# EAGLE design AmazonDash (EAGLE 7.7.0)
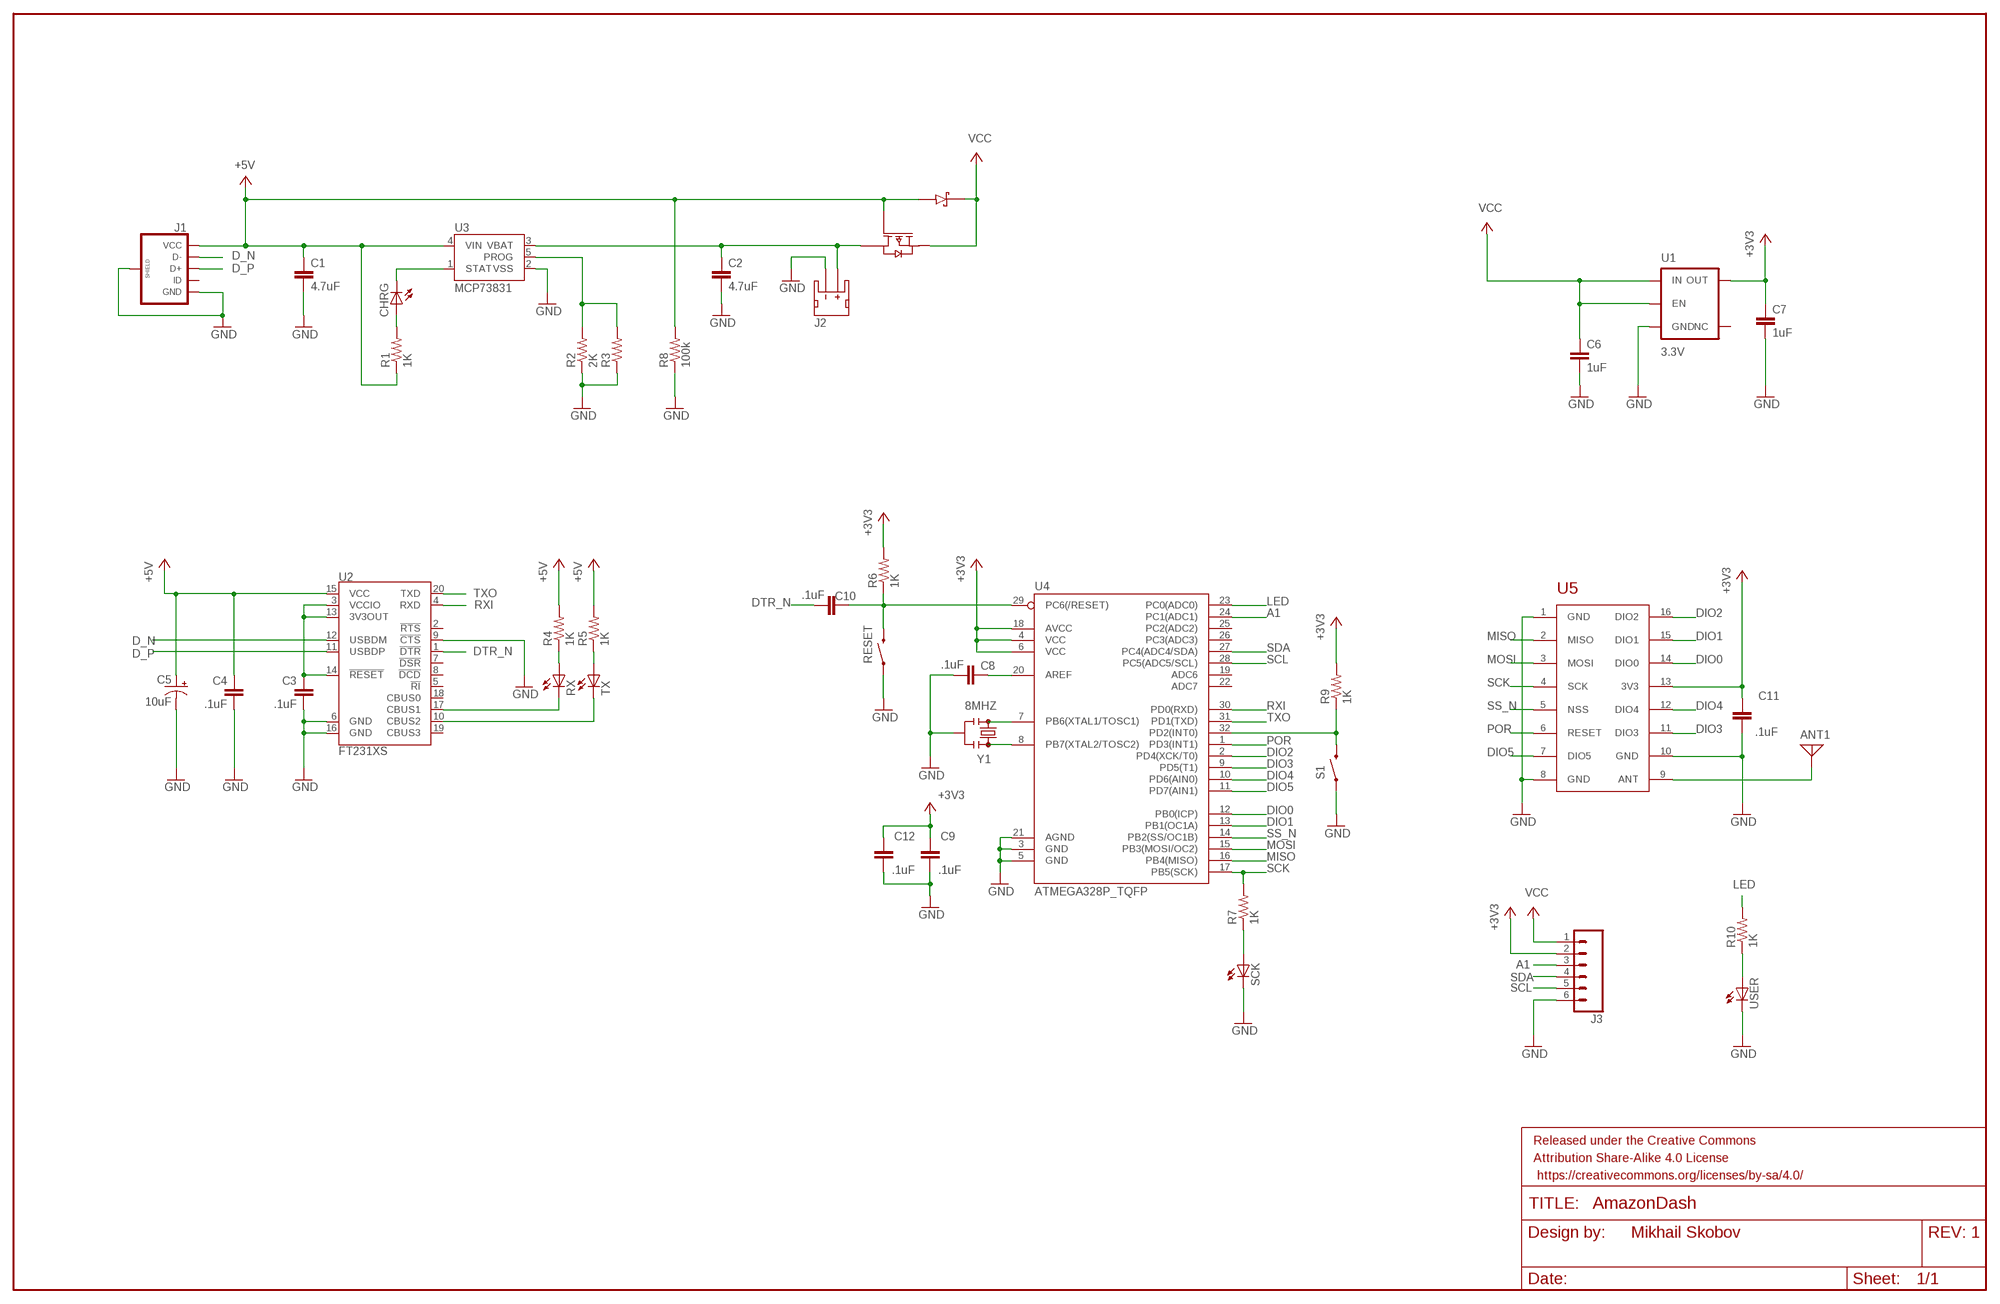
[diagram p0: schematic, sheet 1]

## Parts
ANT1  ANTENNA  [PAD-01]
C1  4.7uF  C-EUC0805  [C0805]
C2  4.7uF  C-EUC0805  [C0805]
C3  .1uF  C-EUC0805  [C0805]
C4  .1uF  C-EUC0805  [C0805]
C5  10uF  10UF-16V-10%(TANT)  [EIA3216]
C6  1uF  C-EUC0805  [C0805]
C7  1uF  C-EUC0805  [C0805]
C8  .1uF  C-EUC0805  [C0805]
C9  .1uF  C-EUC0805  [C0805]
C10  .1uF  C-EUC0805  [C0805]
C11  .1uF  C-EUC0805  [C0805]
C12  .1uF  C-EUC0805  [C0805]
CHRG  LEDCHIPLED_0805  [CHIPLED_0805]
FRAME2  FRAME-LEDGER  [CREATIVE_COMMONS]
J1  USB_MICROB_PLUGCONN-11752  [USB-B-MICRO-SMD_V03]
J2  JST_2MM_MALE  [JST-2-SMD]
J3  M06LOCK  [1X06_LOCK]
R1  1K  R-US_R0805  [R0805]
R2  2K  R-US_R0805  [R0805]
R3  R-US_R0805  [R0805]
R4  1K  R-US_R0805  [R0805]
R5  1K  R-US_R0805  [R0805]
R6  1K  R-US_R0805  [R0805]
R7  1K  R-US_R0805  [R0805]
R8  100k  R-US_R0805  [R0805]
R9  1K  R-US_R0805  [R0805]
R10  1K  R-US_R0805  [R0805]
RESET  SWITCH-MOMENTARY-2SMD  [TACTILE-SWITCH-SMD]
RX  LEDCHIPLED_0805  [CHIPLED_0805]
S1  SWITCH-MOMENTARY-2SMD  [TACTILE-SWITCH-SMD]
SCK  LEDCHIPLED_0805  [CHIPLED_0805]
TX  LEDCHIPLED_0805  [CHIPLED_0805]
U1  3.3V  V_REG_AP2112K-3.3V  [SOT23-5]
U2  FT231XS  [SSOP20_L]
U3  MCP73831  [SOT23-5]
U4  ATMEGA328P_TQFP  [TQFP32-08]
U5  RFM69HCW  [RFM69]
U6  FDC6392S  [SSOT-6]
USER  LEDCHIPLED_0805  [CHIPLED_0805]
Y1  8MHZ  RESONATOR8MHZ  [RESONATOR-SMD]

## Nets
+3V3: C7.1 C9.2 C11.2 C12.2 J3.2 R6.2 R9.2 U1.5(OUT) U4.4(VCC) U4.6(VCC) U4.18(AVCC) U5.13(3V3)
+5V: C1.1 C4.1 C5.A(+) J1.VBUS(VCC) R1.1 R4.2 R5.2 R8.2 U2.15(VCC) U3.4(VIN) U6.1(A) U6.3(G)
A1: J3.3 U4.24(PC1(ADC1))
D_N [USB]: J1.D- U2.12(USBDM)
D_P [USB]: J1.D+ U2.11(USBDP)
DIO0: U4.12(PB0(ICP)) U5.14(DIO0)
DIO1: U4.13(PB1(OC1A)) U5.15(DIO1)
DIO2: U4.2(PD4(XCK/T0)) U5.16(DIO2)
DIO3: U4.9(PD5(T1)) U5.11(DIO3)
DIO4: U4.10(PD6(AIN0)) U5.12(DIO4)
DIO5: U4.11(PD7(AIN1)) U5.7(DIO5)
DTR_N: C10.1 U2.1(!DTR)
GND: C1.2 C2.2 C3.2 C4.2 C5.C(-) C6.2 C7.2 C8.1 C9.1 C11.1 C12.1 J1.GND J1.SHIELD1(SHIELD) J1.SHIELD2(SHIELD) J1.SHIELD3(SHIELD) J2.1(-) J3.6 R2.1 R3.1 R8.1 RESET.1 S1.1 SCK.C U1.2(GND) U2.6(GND) U2.9(!CTS) U2.16(GND) U3.2(VSS) U4.3(GND) U4.5(GND) U4.21(AGND) U5.1(GND) U5.8(GND) U5.10(GND) USER.C Y1.2
LED: R10.2 U4.23(PC0(ADC0))
MISO: U4.16(PB4(MISO)) U5.2(MISO)
MOSI: U4.15(PB3(MOSI/OC2)) U5.3(MOSI)
N$1: RX.C U2.17(CBUS1)
N$2: CHRG.C U3.1(STAT)
N$3: CHRG.A R1.2
N$4: R4.1 RX.A
N$5: R5.1 TX.A
N$6: R2.2 R3.2 U3.5(PROG)
N$7: TX.C U2.10(CBUS2)
N$8: C3.1 U2.3(VCCIO) U2.13(3V3OUT) U2.14(!RESET)
N$9: R9.1 S1.3 U4.32(PD2(INT0))
N$10: R10.1 USER.A
N$13: R7.1 SCK.A
N$14: C10.2 R6.1 RESET.3 U4.29(PC6(/RESET))
N$15: C8.2 U4.20(AREF)
N$16: U4.7(PB6(XTAL1/TOSC1)) Y1.1
N$17: U4.8(PB7(XTAL2/TOSC2)) Y1.3
N$28: ANT1.1 U5.9(ANT)
POR: U4.1(PD3(INT1)) U5.6(RESET)
RXI: U2.4(RXD) U4.30(PD0(RXD))
SCK: R7.2 U4.17(PB5(SCK)) U5.4(SCK)
SCL: J3.5 U4.28(PC5(ADC5/SCL))
SDA: J3.4 U4.27(PC4(ADC4/SDA))
SS_N: U4.14(PB2(SS/OC1B)) U5.5(NSS)
TXO: U2.20(TXD) U4.31(PD1(TXD))
VBAT: C2.1 J2.2(+) U3.3(VBAT) U6.4(S)
VCC: C6.1 J3.1 U1.1(IN) U1.3(EN) U6.2(D) U6.6(C)
Unconnected: J1.ID J2.NC1(PAD1) J2.NC2(PAD2) U1.4(NC) U2.2(!RTS) U2.5(!RI) U2.7(!DSR) U2.8(!DCD) U2.18(CBUS0) U2.19(CBUS3) U4.19(ADC6) U4.22(ADC7) U4.25(PC2(ADC2)) U4.26(PC3(ADC3))

## Notes on the sheet
- Mikhail Skobov | 1

## Library data of the parts
ANT1 = discrete:ANTENNA: Antenna
C1-C4 C6-C12 = resistor:C-EU: CAPACITOR, European symbol
C5 = SparkFun-Capacitors:10UF-16V-10%(TANT): CAP-00811 1206/EIA-3216 Tantalum capacitor; PROD_ID: CAP-00811
CHRG RX SCK TX USER = led:LED: LED OSRAM: - CHIPLED LG R971, LG N971, LY N971, LG Q971, LY Q971, LO R971, LY R971 LH N974, LH R974 LS Q976, LO Q976, LY Q976 LO Q996 - Hyper CHIPLED LW Q18S LB Q993, LB Q99A, LB R99A - SideLED LS A670, LO A670, LY A670, LG A670, LP A670 LB A673, LV A673, LT A673, LW A673 LH A674 LY A675 LS A676, LA A676, LO A676, LY A676, LW A676 LS A679, LY A679, LG A679 - Hyper Micro SIDELED® LS Y876, LA Y876, LO Y876, LY Y876 LT Y87S - SmartLED LW L88C, LW L88S LB L89C, LB L89S, LG L890 LS L89K, LO L89K, LY L89K LS L896, LA L896, LO L896, LY L896 - TOPLED LS T670, LO T670, LY T670, LG T670, LP T670 LSG T670, LSP T670, LSY T670, LOP T670, LYG T670 LG T671, LOG T671, LSG T671 LB T673, LV T673, LT T673, LW T673 LH T674 LS T676, LA T676, LO T676, LY T676, LB T676, LH T676, LSB T676, LW T676 LB T67C, LV T67C, LT T67C, LS T67K, LO T67K, LY T67K, LW E67C LS E67B, LA E67B, LO E67B, LY E67B, LB E67C, LV E67C, LT E67C LW T67C LS T679, LY T679, LG T679 LS T770, LO T770, LY T770, LG T770, LP T770 LB T773, LV T773, LT T773, LW T773 LH T774 LS E675, LA E675, LY E675, LS T675 LS T776, LA T776, LO T776, LY T776, LB T776 LHGB T686 LT T68C, LB T68C - Hyper Mini TOPLED® LB M676 - Mini TOPLED Santana® LG M470 LS M47K, LO M47K, LY M47K Source: http://www.osram.convergy.de LUXEON: - LUMILED® LXK2-PW12-R00, LXK2-PW12-S00, LXK2-PW14-U00, LXK2-PW14-V00 LXK2-PM12-R00, LXK2-PM12-S00, LXK2-PM14-U00 LXK2-PE12-Q00, LXK2-PE12-R00, LXK2-PE12-S00, LXK2-PE14-T00, LXK2-PE14-U00 LXK2-PB12-K00, LXK2-PB12-L00, LXK2-PB12-M00, LXK2-PB14-N00, LXK2-PB14-P00, LXK2-PB14-Q00 LXK2-PR12-L00, LXK2-PR12-M00, LXK2-PR14-Q00, LXK2-PR14-R00 LXK2-PD12-Q00, LXK2-PD12-R00, LXK2-PD12-S00 LXK2-PH12-R00, LXK2-PH12-S00 LXK2-PL12-P00, LXK2-PL12-Q00, LXK2-PL12-R00 Source: www.luxeon.com KINGBRIGHT: KA-3528ASYC Source: www.kingbright.com
FRAME2 = SparkFun-Aesthetics:FRAME-LEDGER: Schematic Frame Standard 11x14 US Ledger frame
J1 = SparkFun-Connectors:USB_MICROB_PLUG: USB Micro-B connectors Some male, some female. Watch your step!; PROD_ID: CONN-11752
J2 = SparkFun-Connectors:JST_2MM_MALE: Mates to single-cell LiPo batteries. CONN-11443 Now with smashable polarity marks!; BTM_NEG: -; BTM_POS: +; PROD_ID: CONN-11443; TOP_NEG: -; TOP_POS: +
J3 = SparkFun-Connectors:M06: Header 6 Standard 6-pin 0.1" header. Use with straight break away headers (SKU : PRT-00116), right angle break away headers (PRT-00553), swiss pins (PRT-00743), machine pins (PRT-00117), and female headers (PRT-00115). Molex polarized connector foot print use with SKU : PRT-08094 with associated crimp pins and housings. NOTES ON THE VARIANTS LOCK and LOCK_LONGPADS... This footprint was designed to help hold the alignment of a through-hole component (i.e. 6-pin header) while soldering it into place. You may notice that each hole has been shifted either up or down by 0.005 of an inch from it's more standard position (which is a perfectly straight line). This slight alteration caused the pins (the squares in the middle) to touch the edges of the holes. Because they are alternating, it causes a "brace" to hold the component in place. 0.005 has proven to be the perfect amount of "off-center" position when using our standard breakaway headers. Although looks a little odd when you look at the bare footprint, once you have a header in there, the alteration is very hard to notice. Also,if you push a header all the way into place, it is covered up entirely on the bottom side. This idea of altering the position of holes to aid alignment will be further integrated into the Sparkfun Library for other footprints. It can help hold any component with 3 or more connection pins.
R1-R10 = resistor:R-US_: RESISTOR, American symbol
RESET S1 = SparkFun-Electromechanical:SWITCH-MOMENTARY-2: Various NO switches- pushbuttons, reed, etc; PROD_ID: SWCH-08247
U1 = SparkFun-PowerIC:V_REG_AP2112: AP2112 - 600mA CMOS LDO Regulator w/ Enable The AP2112 is CMOS process low dropout linear regulator with enable function, the regulator delivers a guaranteed 600mA (min.) continuous load current. Features Output Voltage Accuracy: ±1.5% Output Current: 600mA (Min.) Foldback Short Current Protection: 50mA Enable Function to Turn ON/OFF VOUT Low Dropout Voltage (3.3V): 250mV (Typ.) @IOUT=600mA Excellent Load Regulation: 0.2%/A (Typ.) Excellent Line Regulation: 0.02%/V (Typ.) Low Quiescent Current: 55μA (Typ.) Low Standby Current: 0.01μA (Typ.) Low Output Noise: 50μVRMS PSRR: 100Hz -65dB, 1kHz -65dB OTSD Protection Stable with 1.0μF Flexible Cap: Ceramic, Tantalum and Aluminum Electrolytic Operation Temperature Range: -40°C to 85°C ESD: MM 400V, HBM 4000V; PROD_ID: VREG-12457
U2 = SparkFun-DigitalIC:FT231X: FTDI FT231X Full Speed USB to Full-handshake UART This USB2.0 Full Speed IC offers a compact bridge to full handshake UART interfaces. The device is a UART, capable of operating up to 3MBaud, with low power consumption (8mA). The FT231X includes the complete FT-X series feature set and enables USB to be added into a system design quickly and easily over a UART interface.; PROD_ID: IC-11524
U3 = SparkFun-PowerIC:MCP73831: Miniature single cell, fully integrated Li-Ion, Li-polymer charge management controller http://ww1.microchip.com/downloads/en/DeviceDoc/20001984g.pdf IC-09995; PROD_ID: IC-09995
U4 = SparkFun-DigitalIC:ATMEGA328P_TQFP; PROD_ID: IC-09069
U5 = Master:RFM69HCW: RFM69HCW: Wireless Transciever - 915MHz Datasheet: https://cdn.sparkfun.com/datasheets/Wireless/General/RFM69HCW-V1.1.pdf Product page: https://www.sparkfun.com/products/13909
U6 = Master:FDC6392S: FDC6392S - 20V P-Channel MOSFET and Schottky Diode Datasheet: https://www.fairchildsemi.com/datasheets/FD/FDC6392S.pdf
Y1 = SparkFun-FreqCtrl:RESONATOR: Resonator Small SMD resonator. Used, eg, on the Arduino Pro/ Pro Mini boards. 8MHz- XTAL-08895 16MHz- XTAL-08900; PROD_ID: XTAL-08895

## Net classes
1 USB: width 0.406 mm, clearance 0.203 mm

## Board
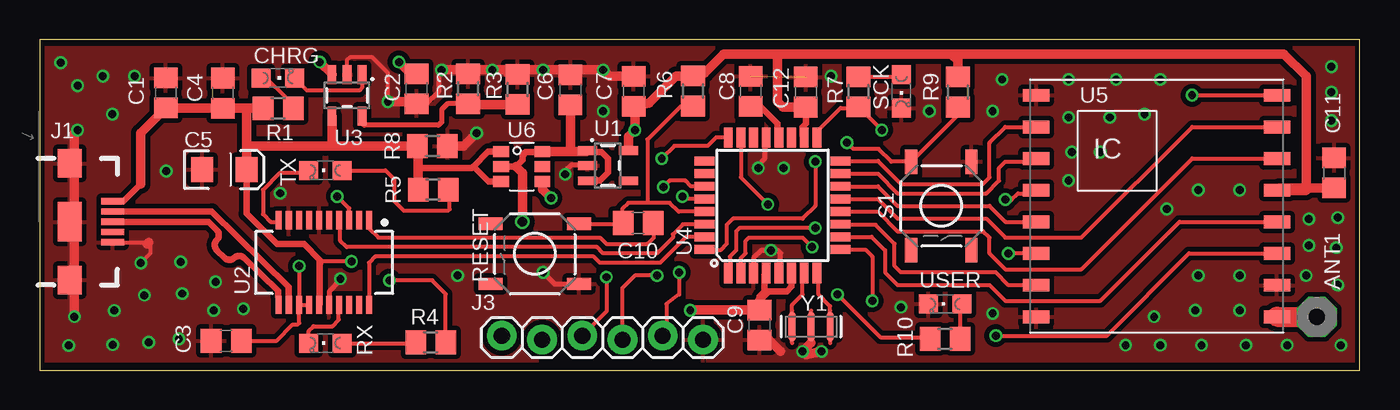
[diagram p1: board, top side]
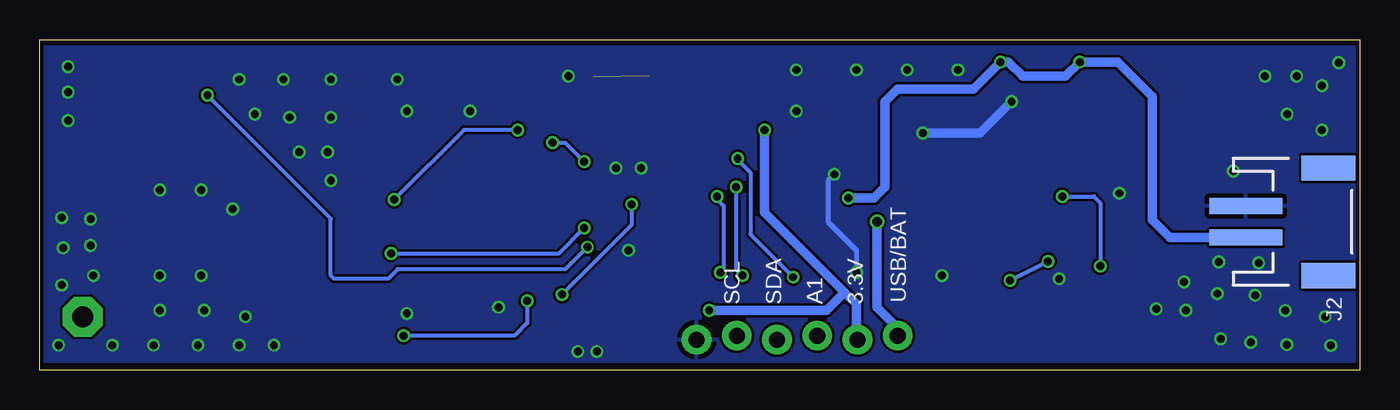
[diagram p2: board, bottom side, seen from below]

Size 83.4 x 20.92 mm. Coordinates in mm from the lower left corner, seen from the top.
Outline: 0,0 83.4,0 83.4,20.92 0,20.92 0,0
Copper layers (1*16): Top 0.035mm / dielectric 1.5mm / Bottom 0.035mm
Design rules "SeeedStudio_2layer_DRU_no_angle_20140221 *": minimum track width 6mil, minimum drill 12mil, track to track 6mil, track to pad 6mil, pad to pad 6mil, via to via 6mil, smd to smd 0mil, copper to edge 10mil, drill to drill 10mil, minimum pad ring 10mil, minimum via ring 6mil, stop-mask expansion 2mil, vias tented up to drill 100mil, thermal gap 12mil

### Footprints (pad centres in the part's own frame; a part is rotated, then mirrored left to right if it is on the bottom)
PAD-01 = drill 1.321 pad 2.54 octagon: 1 0,0
C0805 = smd 1.3 x 1.5: 1 -0.95,0; 2 0.95,0
EIA3216 = smd 1.4 x 1.6: A 1.4,0; C -1.4,0
CHIPLED_0805 = smd 1.2 x 1.2: A 0,-1.05; C 0,1.05
USB-B-MICRO-SMD_V03 = smd 1.45 x 0.4: D+ 2.725,0; D- 2.725,0.65; GND 2.725,-1.3; ID 2.725,-0.65; VBUS 2.725,1.3 | smd 1.5 x 1.8: SHIELD1 0,3.685; SHIELD2 0,-3.685 | smd 1.5 x 2.5: SHIELD3 0,0
JST-2-SMD = smd 1 x 4.6: 1 -1,-3.7; 2 1,-3.7 | smd 1.6 x 3.4: NC1 -3.4,1.5; NC2 3.4,1.5
1X06_LOCK = drill 1.016 pad 1.88: 1 0,0; 2 2.54,-0.254; 3 5.08,0; 4 7.62,-0.254; 5 10.16,0; 6 12.7,-0.254
R0805 = smd 1.3 x 1.5: 1 -0.95,0; 2 0.95,0
TACTILE-SWITCH-SMD = smd 1.524 x 0.762: 1 -2.794,1.905; 2 2.794,1.905; 3 -2.794,-1.905; 4 2.794,-1.905
SOT23-5 = smd 0.55 x 1.2: 1 -0.95,-1.3; 2 0,-1.3; 3 0.95,-1.3; 4 0.95,1.3; 5 -0.95,1.3
SSOP20_L = smd 0.381 x 1.143: 1 -2.857,-2.68; 2 -2.223,-2.68; 3 -1.587,-2.68; 4 -0.953,-2.68; 5 -0.318,-2.68; 6 0.318,-2.68; 7 0.953,-2.68; 8 1.587,-2.68; 9 2.223,-2.68; 10 2.857,-2.68; 11 2.857,2.68; 12 2.223,2.68; 13 1.587,2.68; 14 0.953,2.68; 15 0.318,2.68; 16 -0.318,2.68; 17 -0.953,2.68; 18 -1.587,2.68; 19 -2.223,2.68; 20 -2.857,2.68
TQFP32-08 = smd 1.27 x 0.559: 1 -4.293,2.8; 2 -4.293,2; 3 -4.293,1.2; 4 -4.293,0.4; 5 -4.293,-0.4; 6 -4.293,-1.2; 7 -4.293,-2; 8 -4.293,-2.8; 17 4.293,-2.8; 18 4.293,-2; 19 4.293,-1.2; 20 4.293,-0.4; 21 4.293,0.4; 22 4.293,1.2; 23 4.293,2; 24 4.293,2.8 | smd 0.559 x 1.27: 9 -2.8,-4.293; 10 -2,-4.293; 11 -1.2,-4.293; 12 -0.4,-4.293; 13 0.4,-4.293; 14 1.2,-4.293; 15 2,-4.293; 16 2.8,-4.293; 25 2.8,4.293; 26 2,4.293; 27 1.2,4.293; 28 0.4,4.293; 29 -0.4,4.293; 30 -1.2,4.293; 31 -2,4.293; 32 -2.8,4.293
RFM69 = smd 1.676 x 0.813: 1 -7.6,7; 2 -7.6,5; 3 -7.6,3; 4 -7.6,1; 5 -7.6,-1; 6 -7.6,-3; 7 -7.6,-5; 8 -7.6,-7; 9 7.6,-7; 10 7.6,-5; 11 7.6,-3; 12 7.6,-1; 13 7.6,1; 14 7.6,3; 15 7.6,5; 16 7.6,7
SSOT-6 = smd 0.7 x 1: 1 -0.95,-1.3; 2 0,-1.3; 3 0.95,-1.3; 4 0.95,1.3; 5 0,1.3; 6 -0.95,1.3
RESONATOR-SMD = smd 0.45 x 1.905: 1 -1.2,0; 2 0,0; 3 1.2,0

### Placement (x,y rotation side)
ANT1  80.67,3.39 0 top
C1  7.98,17.54 90 top
C2  23.82,17.81 270 top
C3  11.79,1.88 180 top
C4  11.58,17.53 90 top
C5  11.68,12.7 0 top
C6  33.53,17.73 90 top
C7  37.53,17.65 90 top
C8  44.92,17.65 270 top
C9  45.48,2.87 90 top
C10  37.81,9.33 180 top
C11  81.77,12.49 270 top
C12  48.4,17.6 270 top
CHRG  15.05,18.49 270 top
FRAME2  17.25,-16.77 0 top  (outside the outline)
J1  1.91,9.4 0 top
J2  3.5,9.4 270 bottom
J3  29.2,2.2 0 top
R1  15.07,16.57 0 top
R2  27.07,17.81 270 top
R3  30.2,17.76 270 top
R4  24.71,1.77 0 top
R5  24.87,11.43 180 top
R6  41.28,17.66 90 top
R7  51.72,17.62 270 top
R8  24.81,14.18 180 top
R9  58,17.6 90 top
R10  57.2,2 180 top
RESET  31.28,7.37 180 top
RX  18.05,1.73 90 top
S1  56.96,10.4 270 top
SCK  54.43,17.65 180 top
TX  18.05,12.65 90 top
U1  35.9,12.95 270 top
U2  17.97,6.82 180 top
U3  19.42,17.39 180 top
U4  46.3,10.44 90 top
U5  70.56,10.39 0 top
U6  30.46,12.89 270 top
USER  57.2,4.2 90 top
Y1  48.74,2.76 0 top

### Tracks (layer width: path | path; a pad name or v marks a point on that pad's centre or on a via)
+3V3  (via drill 0.5)
  Top 0.406: U4.4 45.8,6.05 45.8,5 45.48,4.68 45.48,4.4 46.08,5 47.2,5 47.5,5.3 U4.6 | C12.2 48.4,15.6 48.2,15.4 48.2,14.83 U4.18
  Top 0.61: U1.5 37.2,14.8 v37.6,15.2 37.6,16.83 C7.1 38.5,16.9 40.2,18.6 41.07,18.6 R6.2 42.01,18.81 43.2,20 46.4,20 | 46.4,20 57.6,20 | 57.6,20 58,19.6 R9.2 | C12.2 46.95,16.65 46.6,17 46.6,19.8 46.4,20 | C11.2 78.31,11.54 U5.13 79.99,11.39 80,11.4 80,18.6 78.6,20 57.6,20 | v41.1,3.8 41.12,3.82 C9.2 45.48,4.4
  Bottom 0.61: v37.6,15.2 37.6,10 32.55,4.95 | 32.55,4.95 31.8,4.2 31.8,2.01 J3.2 | v41.1,3.8 33.7,3.8 32.55,4.95
+5V  (via drill 0.5)
  Top 0.254: R4.2 25.66,4.84 24.8,5.7 v22.1,5.7 | v19.7,6.9 17.8,6.9 17.7,5.6
  Top 0.406: C5.A 13.08,9.92 15,8 16.7,8 17.7,7 17.7,5.6 17.7,4.19 U2.15 | J1.VBUS 5.3,10.7 6.4,11.8 | U6.1 28.34,13.84 27.4,12.9 | 27.4,12.9 27.3,12.8 23.92,12.8 | U6.3 28.36,11.94 27.4,12.9
  Top 0.61: 6.4,11.8 6.4,15.01 C1.1 C4.1 13.1,16.58 | 13.1,16.58 R1.1 | C5.A 13.08,14.2 | 13.08,14.2 13.08,16.56 13.1,16.58 | R5.2 23.92,12.8 23.92,14.12 R8.2 18.3,14.18 | 18.3,14.18 13.1,14.18 13.08,14.2 | U3.4 18.47,14.35 18.3,14.18
  Bottom 0.254: v22.1,5.7 v19.7,6.9
A1  (via drill 0.5)
  Top 0.254: U4.24 42.73,14.73 42.2,14.2 40.1,14.2 v39.3,13.4 | v35.8,5.9 35.8,3.72 J3.3
  Bottom 0.254: v39.3,13.4 39.3,13.3 38.5,12.5 38.5,8.6 v35.8,5.9
D_N
  Top 0.406: J1.D- 5.28,10.05 10.88,10.05 15.75,5.28 U2.12
D_P
  Top 0.406: J1.D+ 5.08,9.39 10.67,9.39 11.19,8.89 arc-90 11.19,8.25 arc90 11.2,7.6 11.7,7.11 arc90 12.3,7.12 arc-90 12.92,7.1 15.06,5.03 U2.11
DIO0
  Top 0.254: U4.12 52.96,10.04 54.2,8.8 59.6,8.8 60,8.4 60,7.4 61,6.4 65.8,6.4 72.8,13.4 U5.14
DIO1
  Top 0.254: U4.13 52.96,10.84 54.2,9.6 59.8,9.6 61,8.4 65.8,8.4 72.8,15.4 U5.15
DIO2  (via drill 0.5)
  Top 0.254: U4.2 44.3,7.1 44.6,7.4 44.6,8.2 44.8,8.4 48.2,8.4 v48.8,7.8 | v72.8,17.4 U5.16
  Bottom 0.254: v48.8,7.8 50.2,6.4 60.8,6.4 61.4,5.8 64.8,5.8 65,6 65,9.6 v72.8,17.4
DIO3  (via drill 0.5)
  Top 0.254: U4.9 52.16,7.64 52.6,7.2 v52.6,4.4 | v60.4,2.2 67.4,2.2 72.6,7.4 U5.11
  Bottom 0.254: v52.6,4.4 52.6,3 53.4,2.2 v60.4,2.2
DIO4
  Top 0.254: U4.10 52.56,8.44 53.4,7.6 53.4,6.2 54.2,5.4 60,5.4 61,4.4 67,4.4 72,9.4 U5.12
DIO5
  Top 0.254: U5.7 61.21,5.39 60.4,6.2 54.4,6.2 54,6.6 54,8 52.8,9.2 50.63,9.2 U4.11
DTR_N
  Top 0.254: U2.1 20.83,8.97 21.4,8.4 35.4,8.4 35.8,8 38.4,8 38.8,8.4 38.8,9.29 C10.1
GND  (via drill 0.5)  (1 unrouted)
  Top 0.254: J1.GND 6.9,8.1 7,8 7,7.4 v6.4,6.8 | C2.2 22.14,16.86 v22,17 22,18.8 21,19.8 19.6,19.8 19.4,19.6 19.4,18.71 U3.2
  Top 0.305: v25.4,19 25.2,18.8 25.2,17.6 24.46,16.86 C2.2 | U1.2 34.55,13 33.6,13 33.2,12.6 v33.2,12.4 | v31.8,6.2 32.53,5.47 RESET.1 | U4.5 46.8,6.25 46.8,7.4 46.6,7.6 v46.2,7.6 45.6,7.6 45.1,7.1 U4.3 | U4.21 45.8,14.63 45.8,13.4 45.4,13 v45.4,12.8 | U2.16 18.31,4.17 18.31,5 19,5.68 v19,5.8
  Top 0.61: R8.1 26.78,14.18 v27.6,15 | C2.2 23.68,17 v22,17 | v25.4,19 26.83,19 R2.1 27.31,19 v28.6,19 29.4,19 29.69,18.71 R3.1 30.49,19 v31.8,19 33.2,19 C6.2 33.85,19 v35.6,19 36,18.6 C7.2 | v2.4,15.2 2.2,15 v2.2,3.4 | 6.9,8.1 6.8,8 | 48.74,1.74 v48.2,1.2 | v48.2,1.2 | v48.2,1.2 48.4,1 v49.4,1.2 | v48.2,1.2 | 46.8,1.2 46.08,1.92 C9.1
  Bottom 0.305: v33.2,12.4 33.6,12 33.6,9.4 31.8,7.6 v31.8,6.2
  Bottom 0.61: v22,17 24,15 v27.6,15
  other vias: 50,18.6 8.8,2 11,3.8 8,12.6 2.4,18 6,18.6 4,18.6 4.6,16.2 26.4,6 15.2,11.2 35.6,16.4 60.8,18.4 60.2,16.4 65,18.4 68,18.4 70.8,18.4 65,16 67.6,16 69.8,16.2 67,13.8 65.2,13.8 65,12 75.8,11.4 73.2,11.4 71.2,10.2 73.2,6 75.8,6 75.8,3.8 73,3.8 70.4,3.4 81.6,19.2 81.6,17.6 81.6,15.8 80,6 82,5.4 82.2,1.6 78.8,1.6 76.2,1.6 73.4,1.6 70.8,1.6 68.6,1.6 47,12.8 56.2,16.4 60.2,3.6 54.4,4 80.18,7.91 80.18,9.58 82.01,9.66 81.91,7.75 8.91,6.86 11.12,5.59 12.87,3.89 9.01,4.86 6.62,4.76 4.71,3.79 1.84,1.58 4.61,1.63 6.9,1.78 1.34,19.46
  pour Top (isolate 0.305): 0.2,20.4 83.2,20.4 83.2,0.6 0.2,0.6
  pour Bottom: 0.2,20.4 83.2,20.4 83.2,0.6 0.2,0.6
LED  (via drill 0.5)
  Top 0.254: U4.23 44.3,12.2 v46,10.5 | v50.4,4.8 53.1,2.1 56.15,2.1 R10.2
  Bottom 0.254: v46,10.5 46,9.2 v50.4,4.8
MISO
  Top 0.254: U4.16 52.96,13.24 54.4,11.8 59.6,11.8 60,12.2 60,14.4 61,15.4 U5.2
MOSI
  Top 0.254: U4.15 52.96,12.44 54.2,11.2 59.8,11.2 60.6,12 60.6,12.8 61,13.2 62.77,13.2 U5.3
N$1
  Top 0.254: RX.C 17,2.5 17.3,2.8 18.5,2.8 18.9,3.2 18.9,4.12 U2.17
N$2
  Top 0.254: U3.1 20.37,17.87 20.2,17.7 16.89,17.7 CHRG.C
N$3
  Top 0.254: CHRG.A 14.31,18.49 15.5,17.3 15.5,17.09 R1.2
N$4
  Top 0.254: RX.A 23.72,1.73 R4.1
N$5
  Top 0.254: TX.A 21.85,12.65 22.4,12.1 22.4,10.7 23,10.1 25.8,10.1 25.9,10.2 25.9,11.35 R5.1
N$6
  Top 0.305: R2.2 25.76,16.86 25.4,16.5 25.4,15.7 25.2,15.5 20.5,15.5 20.4,15.6 20.4,16.06 U3.5
  Top 0.61: R3.2 27.12,16.81 R2.2
N$7
  Top 0.254: TX.C 16.85,12.5 15.2,12.5 14.11,11.41 14.11,9.89 14.6,9.4 15.01,9.4 U2.10
N$8  (via drill 0.5)
  Top 0.254: C3.1 14.98,1.88 16,2.9 16.3,2.9 16.4,3 16.4,4.12 U2.13 | U2.13 U2.14 | U2.3 19.56,10.24 v18.8,11 | v16.4,6.6 16.4,4.16 U2.13
  Bottom 0.254: v18.8,11 16.8,11 16.4,10.6 v16.4,6.6
N$9  (via drill 0.5)
  Top 0.254: v51,14.4 51.4,14 53,14 53.81,13.19 S1.3 58,16.14 R9.1 | v49,13.2 49,10.4 48.2,9.6 43.8,9.6 43.4,9.2 43.4,8 43,7.6 42.05,7.6 U4.32
  Bottom 0.254: v51,14.4 50.2,14.4 v49,13.2
N$10
  Top 0.254: R10.1 58.15,4.1 USER.A
N$13
  Top 0.254: R7.1 54.3,18.57 SCK.A
N$14
  Top 0.254: U4.29 40.36,10.04 39.8,10.6 38.4,10.6 | 38.4,10.6 37.2,10.6 36.8,10.2 36.8,9.39 C10.2 36.8,9.28 RESET.3 | R6.1 40.51,16.71 38.4,14.6 38.4,10.6
N$15
  Top 0.406: C8.2 45.5,16.7 46.6,15.6 46.6,14.83 U4.20
N$16
  Top 0.254: 47.54,3.78 47.54,4.14 48.2,4.8 48.2,6.05 U4.7
N$17
  Top 0.254: 49.94,3.78 49.94,4.06 49.2,4.8 49.2,6.05 U4.8
N$28
  Top 1.27: U5.9 ANT1.1
POR  (via drill 0.5)
  Top 0.254: U5.6 v61.21,7.39 v61.2,7.4 | v49,9 44.2,9 44,8.8 44,7.6 43.6,7.2 43.6,6.25 U4.1
  Bottom 0.254: v61.2,7.4 50.6,7.4 v49,9
RXI
  Top 0.254: U4.30 40.64,9.24 40,8.6 40,8.4 39,7.4 35.6,7.4 35.2,7.8 19.4,7.8 19,8.2 19,9.42 U2.4
SCK  (via drill 0.5)
  Top 0.254: U4.17 49.1,15.1 50.6,16.6 51.45,16.6 R7.2 v53.2,15.2 | v61,10.8 61.4,10.8 61.8,11.2 62.77,11.2 U5.4
  Bottom 0.254: v53.2,15.2 56.6,15.2 v61,10.8
SCL  (via drill 0.5)
  Top 0.254: U4.28 40.84,10.84 v40.6,11 | v40.4,6.2 40.4,4.8 39.6,4.2 39.6,2.44 J3.5
  Bottom 0.254: v40.6,11 40.6,10.8 40.2,10.4 40.2,6.4 v40.4,6.2 | 39.4,2.24 J3.5
SDA  (via drill 0.5)
  Top 0.254: U4.27 41.16,11.64 40.8,12 39.8,12 v39.4,11.6 | v39,6 37.6,6 36.8,5.2 36.8,1.97 J3.4
  Bottom 0.254: v39.4,11.6 39.4,6.4 v39,6
SS_N
  Top 0.254: U4.14 52.96,11.64 54.2,10.4 60,10.4 61.01,9.39 U5.5
TXO
  Top 0.254: U4.31 40.84,8.44 39.2,6.8 35.4,6.8 35,7.2 21.2,7.2 20.8,6.8 20.8,4.17 U2.20
VBAT  (via drill 0.5)
  Top 0.61: U3.3 18.47,18.73 v17.7,19.5 | C2.1 23.44,18.76 v22.7,19.5 | U6.4 31.76,11.44 v32.3,10.9
  Bottom 0.61: J2.2 7.3,8.3 8.1,8.3 8.2,8.4 12,8.4 13.1,9.5 13.1,17.3 15.3,19.5 v17.7,19.5 18.6,18.6 21.3,18.6 22.2,19.5 v22.7,19.5 24.4,17.8 29.2,17.8 30,17 30,11.6 30.7,10.9 v32.3,10.9
VCC  (via drill 0.6)
  Top 0.406: U6.2 30.09,12.89 30.5,13.3 30.5,13.6 30.7,13.8 31.72,13.8 U6.6 | U1.3 35.4,12 35.9,12.5 35.9,13.4 35.5,13.8 34.7,13.8 U1.1
  Top 0.61: U6.6 33.6,13.84 | 33.6,13.84 34.54,13.84 U1.1 | C6.1 33.53,13.91 33.6,13.84 | v30.5,9.4 30.5,12.48 30.09,12.89
  Bottom 0.61: J3.1 29.2,2.7 30.5,4 v30.5,9.4

### Text on the board
bPlace: USB/BAT | 3.3V | A1 | SDA | SCL